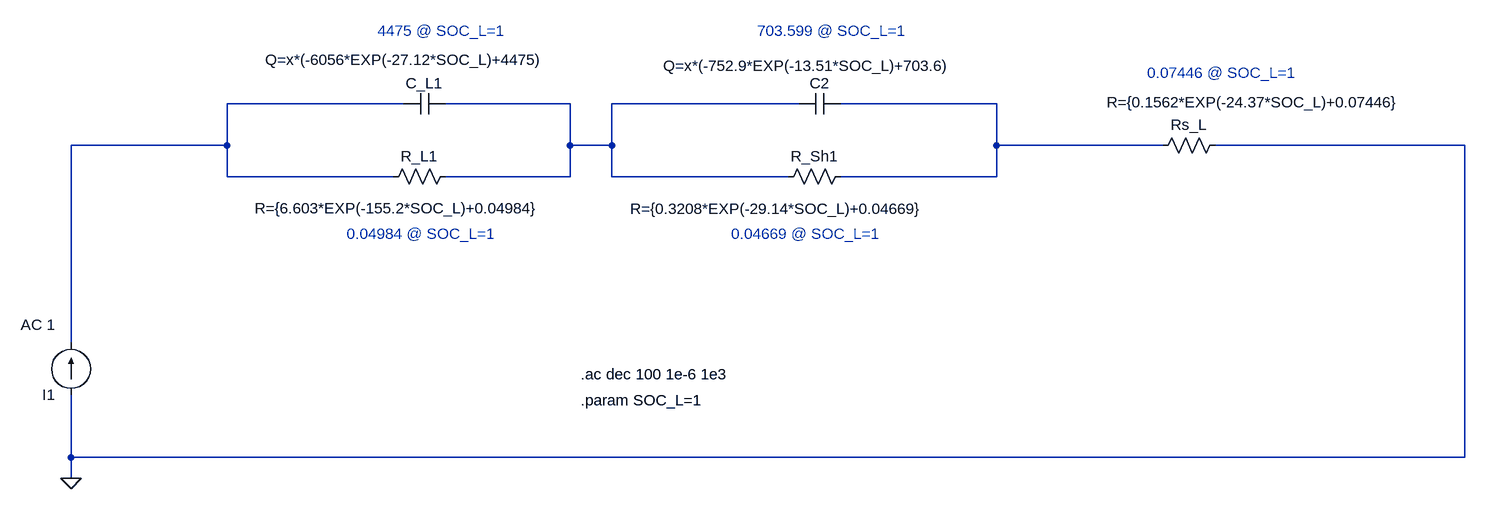
[diagram p0: schematic test.asc]
test.asc, the LTspice schematic file:
Version 4
SHEET 1 4372 1412
WIRE -80 64 -352 64
WIRE 176 64 -16 64
WIRE 528 64 240 64
WIRE 832 64 592 64
WIRE -352 128 -352 64
WIRE -352 128 -592 128
WIRE 176 128 176 64
WIRE 240 128 240 64
WIRE 240 128 176 128
WIRE 832 128 832 64
WIRE 1088 128 832 128
WIRE 1552 128 1168 128
WIRE -352 176 -352 128
WIRE -96 176 -352 176
WIRE 176 176 176 128
WIRE 176 176 -16 176
WIRE 240 176 240 128
WIRE 512 176 240 176
WIRE 832 176 832 128
WIRE 832 176 592 176
WIRE -592 432 -592 128
WIRE -592 608 -592 512
WIRE 1552 608 1552 128
WIRE 1552 608 -592 608
WIRE -592 640 -592 608
FLAG -592 640 0
SYMBOL res 0 160 R90
WINDOW 0 0 56 VBottom 2
WINDOW 3 49 89 VTop 2
SYMATTR InstName R_L1
SYMATTR Value R={6.603*EXP(-155.2*SOC_L)+0.04984}
SYMBOL res 608 160 R90
WINDOW 0 0 56 VBottom 2
WINDOW 3 50 113 VTop 2
SYMATTR InstName R_Sh1
SYMATTR Value R={0.3208*EXP(-29.14*SOC_L)+0.04669}
SYMBOL res 1184 112 R90
WINDOW 0 0 56 VBottom 2
WINDOW 3 -66 -44 VTop 2
SYMATTR InstName Rs_L
SYMATTR Value R={0.1562*EXP(-24.37*SOC_L)+0.07446}
SYMBOL cap -16 48 R90
WINDOW 0 0 32 VBottom 2
WINDOW 3 -67 62 VTop 2
SYMATTR InstName C_L1
SYMATTR Value Q=x*(-6056*EXP(-27.12*SOC_L)+4475)
SYMBOL cap 592 48 R90
WINDOW 0 0 32 VBottom 2
WINDOW 3 -58 51 VTop 2
SYMATTR InstName C2
SYMATTR Value Q=x*(-752.9*EXP(-13.51*SOC_L)+703.6)
SYMBOL current -592 512 R180
WINDOW 123 24 108 Left 2
WINDOW 39 0 0 Left 0
SYMATTR InstName I1
SYMATTR Value ""
SYMATTR Value2 AC 1
TEXT 192 480 Left 2 !.ac dec 100 1e-6 1e3
TEXT 1064 16 Left 2 ;0.07446 @ SOC_L=1
TEXT 464 -48 Left 2 ;703.599 @ SOC_L=1
TEXT 424 264 Left 2 ;0.04669 @ SOC_L=1
TEXT -120 -48 Left 2 ;4475 @ SOC_L=1
TEXT -168 264 Left 2 ;0.04984 @ SOC_L=1
TEXT 192 520 Left 2 !.param SOC_L=1

The netlist it stands for:
* test.asc
R_L1 N002 N001 R={6.603*EXP(-155.2*SOC_L)+0.04984}
R_Sh1 N003 N002 R={0.3208*EXP(-29.14*SOC_L)+0.04669}
Rs_L 0 N003 R={0.1562*EXP(-24.37*SOC_L)+0.07446}
C_L1 N002 N001 Q=x*(-6056*EXP(-27.12*SOC_L)+4475)
C2 N003 N002 Q=x*(-752.9*EXP(-13.51*SOC_L)+703.6)
I1 0 N001 AC 1
.ac dec 100 1e-6 1e3
* 0.07446 @ SOC_L=1
* 703.599 @ SOC_L=1
* 0.04669 @ SOC_L=1
* 4475 @ SOC_L=1
* 0.04984 @ SOC_L=1
.param SOC_L=1
.backanno
.end